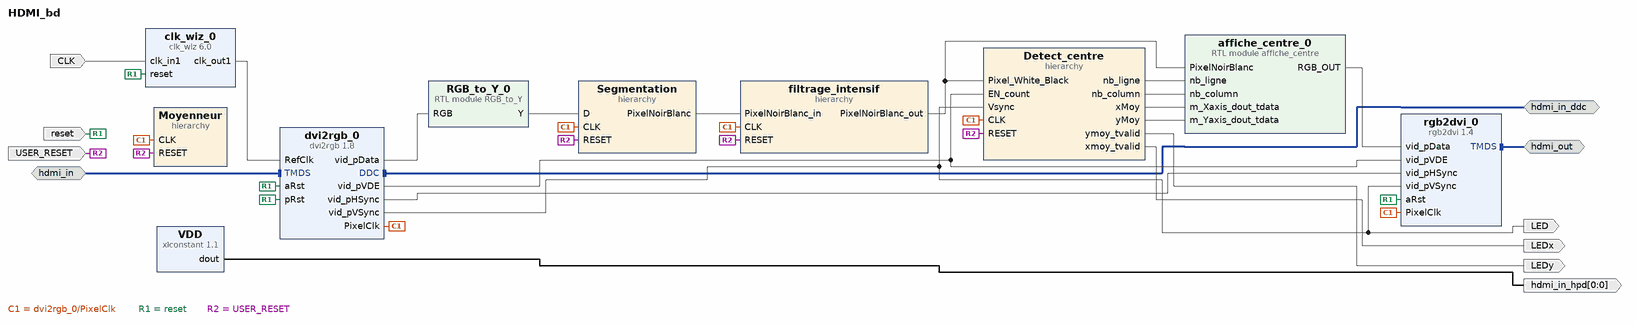
[diagram p0: block diagram of the top level]
# Vivado block design HDMI_bd, xc7z020clg400-1, Vivado 2018.2.1
create_bd_design HDMI_bd

create_bd_intf_port -mode Master -vlnv xilinx.com:interface:iic_rtl:1.0 hdmi_in_ddc
create_bd_intf_port -mode Slave -vlnv digilentinc.com:interface:tmds_rtl:1.0 hdmi_in
create_bd_intf_port -mode Master -vlnv digilentinc.com:interface:tmds_rtl:1.0 hdmi_out
create_bd_port -dir I -type clk CLK
set_property -dict {CONFIG.FREQ_HZ 125000000} [get_bd_ports CLK]
create_bd_port -dir O -from 0 -to 0 hdmi_in_hpd
create_bd_port -dir I -type rst reset
set_property -dict {CONFIG.POLARITY ACTIVE_HIGH} [get_bd_ports reset]
create_bd_port -dir I USER_RESET
create_bd_port -dir O LED
create_bd_port -dir O LEDx
create_bd_port -dir O LEDy

create_bd_cell -type ip -vlnv xilinx.com:ip:clk_wiz:6.0 clk_wiz_0
set_property -dict [list \
  CONFIG.PRIMITIVE PLL \
  CONFIG.CLKOUT1_REQUESTED_OUT_FREQ 200.000 \
  CONFIG.CLKOUT1_DRIVES BUFG \
  CONFIG.CLKOUT2_DRIVES BUFG \
  CONFIG.CLKOUT3_DRIVES BUFG \
  CONFIG.CLKOUT4_DRIVES BUFG \
  CONFIG.CLKOUT5_DRIVES BUFG \
  CONFIG.CLKOUT6_DRIVES BUFG \
  CONFIG.CLKOUT7_DRIVES BUFG \
  CONFIG.MMCM_DIVCLK_DIVIDE 1 \
  CONFIG.MMCM_CLKFBOUT_MULT_F 8 \
  CONFIG.MMCM_COMPENSATION ZHOLD \
  CONFIG.MMCM_CLKOUT0_DIVIDE_F 5 \
  CONFIG.CLKOUT1_JITTER 109.241 \
  CONFIG.CLKOUT1_PHASE_ERROR 96.948 \
] [get_bd_cells clk_wiz_0]
create_bd_cell -type ip -vlnv xilinx.com:ip:xlconstant:1.1 VDD
create_bd_cell -type ip -vlnv digilentinc.com:ip:dvi2rgb:1.8 dvi2rgb_0
set_property -dict [list \
  CONFIG.kEmulateDDC true \
  CONFIG.kEnableSerialClkOutput false \
  CONFIG.kClkRange 3 \
  CONFIG.kEdidFileName dgl_720p_cea.data \
] [get_bd_cells dvi2rgb_0]
create_bd_cell -type ip -vlnv digilentinc.com:ip:rgb2dvi:1.4 rgb2dvi_0
set_property -dict {CONFIG.kClkPrimitive MMCM CONFIG.kGenerateSerialClk true CONFIG.kClkRange 3} [get_bd_cells rgb2dvi_0]
create_bd_cell -type module -reference RGB_to_Y RGB_to_Y_0
create_bd_cell -type hier Segmentation
create_bd_cell -type hier Moyenneur
create_bd_cell -type hier Detect_centre
create_bd_cell -type hier filtrage_intensif
create_bd_cell -type module -reference affiche_centre affiche_centre_0

# ---- hierarchy /Segmentation ----
current_bd_instance /Segmentation
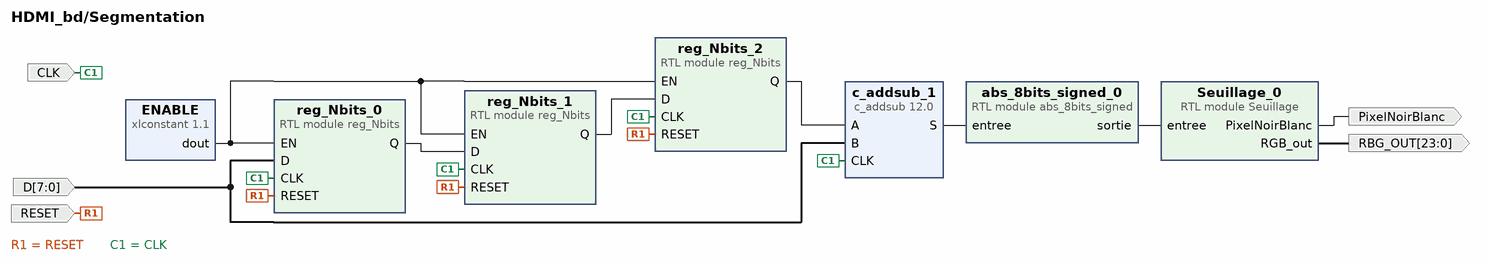
[diagram p1: block diagram inside /Segmentation]
create_bd_pin -dir I -from 7 -to 0 D
create_bd_pin -dir I -type clk CLK
create_bd_pin -dir O -from 23 -to 0 RBG_OUT
create_bd_pin -dir O PixelNoirBlanc
create_bd_pin -dir I RESET

create_bd_cell -type ip -vlnv xilinx.com:ip:xlconstant:1.1 ENABLE
create_bd_cell -type module -reference abs_8bits_signed abs_8bits_signed_0
create_bd_cell -type module -reference reg_Nbits reg_Nbits_0
set_property -dict {CONFIG.N 8} [get_bd_cells reg_Nbits_0]
create_bd_cell -type module -reference reg_Nbits reg_Nbits_1
set_property -dict {CONFIG.N 8} [get_bd_cells reg_Nbits_1]
create_bd_cell -type module -reference Seuillage Seuillage_0
create_bd_cell -type module -reference reg_Nbits reg_Nbits_2
set_property -dict {CONFIG.N 8} [get_bd_cells reg_Nbits_2]
create_bd_cell -type ip -vlnv xilinx.com:ip:c_addsub:12.0 c_addsub_1
set_property -dict [list \
  CONFIG.A_Type Unsigned \
  CONFIG.B_Type Unsigned \
  CONFIG.A_Width 8 \
  CONFIG.B_Width 8 \
  CONFIG.Add_Mode Subtract \
  CONFIG.Out_Width 9 \
  CONFIG.Latency 1 \
  CONFIG.B_Value 00000000 \
  CONFIG.CE false \
] [get_bd_cells c_addsub_1]

# ---- hierarchy /Moyenneur ----
current_bd_instance /Moyenneur
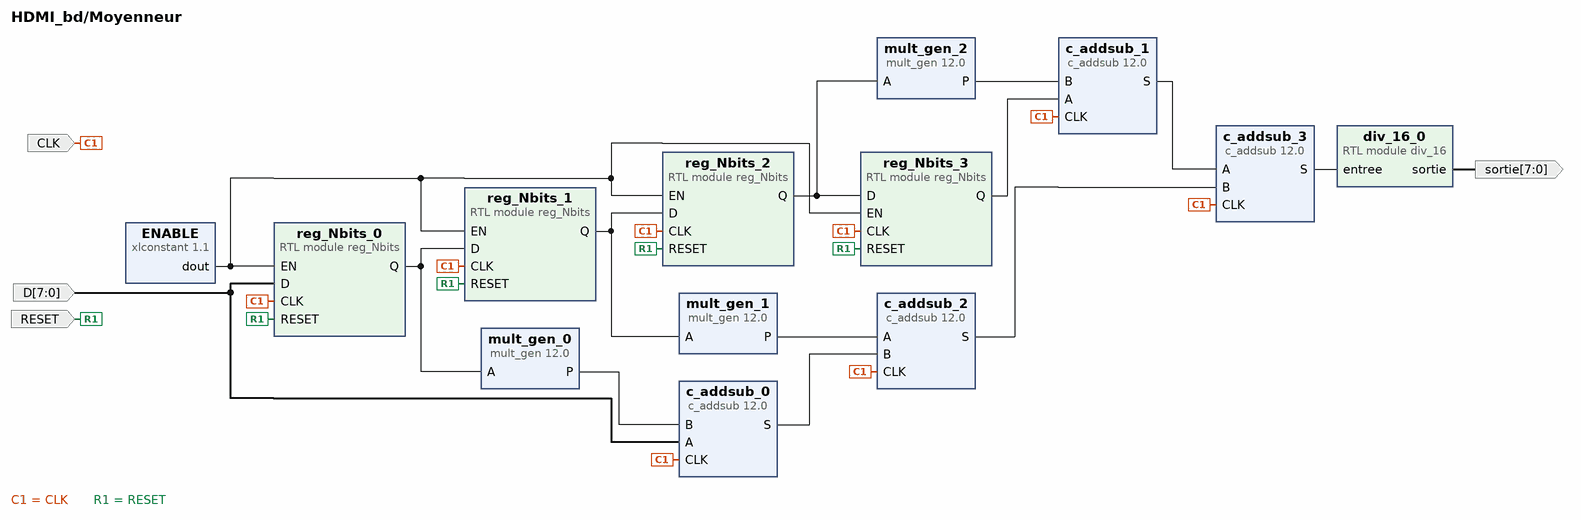
[diagram p2: block diagram inside /Moyenneur]
create_bd_pin -dir I -from 7 -to 0 D
create_bd_pin -dir O -from 7 -to 0 sortie
create_bd_pin -dir I -type clk CLK
create_bd_pin -dir I RESET

create_bd_cell -type ip -vlnv xilinx.com:ip:mult_gen:12.0 mult_gen_0
set_property -dict [list \
  CONFIG.MultType Constant_Coefficient_Multiplier \
  CONFIG.PortAType Unsigned \
  CONFIG.PortAWidth 8 \
  CONFIG.ConstValue 4 \
  CONFIG.Use_Custom_Output_Width false \
] [get_bd_cells mult_gen_0]
create_bd_cell -type ip -vlnv xilinx.com:ip:mult_gen:12.0 mult_gen_1
set_property -dict [list \
  CONFIG.MultType Constant_Coefficient_Multiplier \
  CONFIG.PortAType Unsigned \
  CONFIG.PortAWidth 8 \
  CONFIG.ConstValue 6 \
  CONFIG.Use_Custom_Output_Width false \
  CONFIG.PipeStages 0 \
] [get_bd_cells mult_gen_1]
create_bd_cell -type ip -vlnv xilinx.com:ip:mult_gen:12.0 mult_gen_2
set_property -dict [list \
  CONFIG.MultType Constant_Coefficient_Multiplier \
  CONFIG.PortAType Unsigned \
  CONFIG.PortAWidth 8 \
  CONFIG.ConstValue 4 \
  CONFIG.Use_Custom_Output_Width false \
] [get_bd_cells mult_gen_2]
create_bd_cell -type ip -vlnv xilinx.com:ip:c_addsub:12.0 c_addsub_0
set_property -dict [list \
  CONFIG.A_Width 8 \
  CONFIG.B_Width 11 \
  CONFIG.Out_Width 12 \
  CONFIG.Latency 1 \
  CONFIG.B_Value 00000000000 \
  CONFIG.CE false \
] [get_bd_cells c_addsub_0]
create_bd_cell -type ip -vlnv xilinx.com:ip:c_addsub:12.0 c_addsub_1
set_property -dict [list \
  CONFIG.A_Width 8 \
  CONFIG.B_Width 11 \
  CONFIG.Out_Width 12 \
  CONFIG.Latency 1 \
  CONFIG.B_Value 00000000000 \
  CONFIG.CE false \
] [get_bd_cells c_addsub_1]
create_bd_cell -type ip -vlnv xilinx.com:ip:c_addsub:12.0 c_addsub_2
set_property -dict [list \
  CONFIG.A_Width 11 \
  CONFIG.B_Width 12 \
  CONFIG.Out_Width 13 \
  CONFIG.Latency 1 \
  CONFIG.B_Value 000000000000 \
  CONFIG.CE false \
] [get_bd_cells c_addsub_2]
create_bd_cell -type ip -vlnv xilinx.com:ip:c_addsub:12.0 c_addsub_3
set_property -dict [list \
  CONFIG.A_Width 12 \
  CONFIG.B_Width 13 \
  CONFIG.Out_Width 14 \
  CONFIG.Latency 1 \
  CONFIG.B_Value 0000000000000 \
  CONFIG.CE false \
] [get_bd_cells c_addsub_3]
create_bd_cell -type ip -vlnv xilinx.com:ip:xlconstant:1.1 ENABLE
set_property -dict {CONFIG.CONST_VAL 1} [get_bd_cells ENABLE]
create_bd_cell -type module -reference div_16 div_16_0
create_bd_cell -type module -reference reg_Nbits reg_Nbits_0
set_property -dict {CONFIG.N 8} [get_bd_cells reg_Nbits_0]
create_bd_cell -type module -reference reg_Nbits reg_Nbits_1
set_property -dict {CONFIG.N 8} [get_bd_cells reg_Nbits_1]
create_bd_cell -type module -reference reg_Nbits reg_Nbits_2
set_property -dict {CONFIG.N 8} [get_bd_cells reg_Nbits_2]
create_bd_cell -type module -reference reg_Nbits reg_Nbits_3
set_property -dict {CONFIG.N 8} [get_bd_cells reg_Nbits_3]

# ---- hierarchy /Detect_centre ----
current_bd_instance /Detect_centre
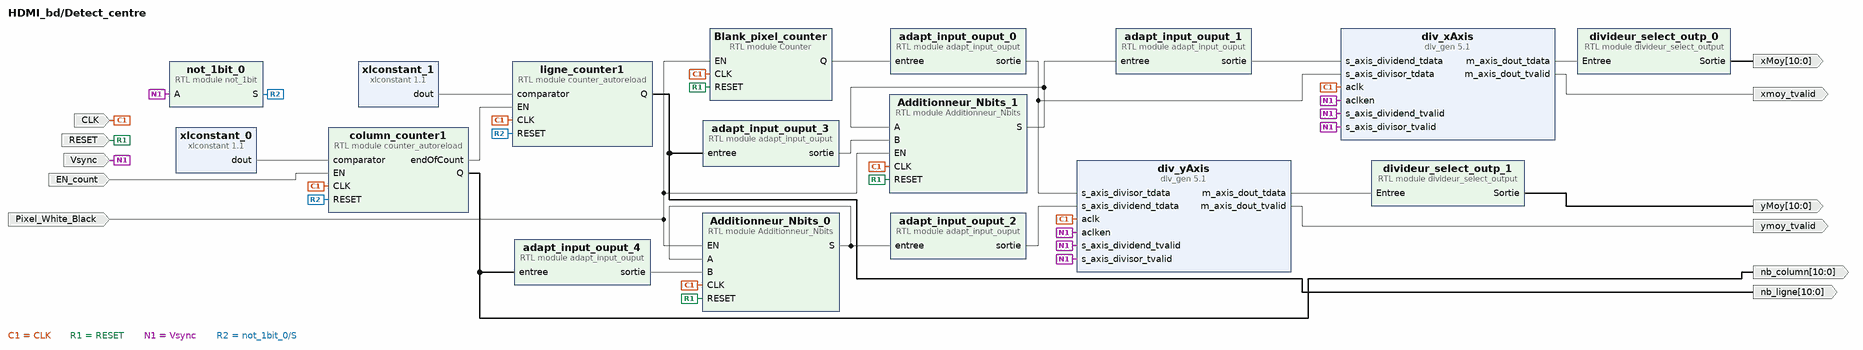
[diagram p3: block diagram inside /Detect_centre]
create_bd_pin -dir I -type clk CLK
create_bd_pin -dir I Pixel_White_Black
create_bd_pin -dir O ymoy_tvalid
create_bd_pin -dir O xmoy_tvalid
create_bd_pin -dir I EN_count
create_bd_pin -dir I RESET
create_bd_pin -dir O -from 10 -to 0 nb_ligne
create_bd_pin -dir O -from 10 -to 0 nb_column
create_bd_pin -dir I Vsync
create_bd_pin -dir O -from 10 -to 0 xMoy
create_bd_pin -dir O -from 10 -to 0 yMoy

create_bd_cell -type module -reference Counter Blank_pixel_counter
set_property -dict {CONFIG.N 11} [get_bd_cells Blank_pixel_counter]
create_bd_cell -type module -reference adapt_input_ouput adapt_input_ouput_0
set_property -dict {CONFIG.N 11 CONFIG.M 16} [get_bd_cells adapt_input_ouput_0]
create_bd_cell -type module -reference adapt_input_ouput adapt_input_ouput_1
set_property -dict {CONFIG.N 18 CONFIG.M 24} [get_bd_cells adapt_input_ouput_1]
create_bd_cell -type module -reference adapt_input_ouput adapt_input_ouput_2
set_property -dict {CONFIG.N 18 CONFIG.M 24} [get_bd_cells adapt_input_ouput_2]
create_bd_cell -type module -reference adapt_input_ouput adapt_input_ouput_3
set_property -dict {CONFIG.N 11 CONFIG.M 18} [get_bd_cells adapt_input_ouput_3]
create_bd_cell -type module -reference adapt_input_ouput adapt_input_ouput_4
set_property -dict {CONFIG.N 11 CONFIG.M 18} [get_bd_cells adapt_input_ouput_4]
create_bd_cell -type ip -vlnv xilinx.com:ip:div_gen:5.1 div_xAxis
set_property -dict [list \
  CONFIG.algorithm_type High_Radix \
  CONFIG.dividend_and_quotient_width 18 \
  CONFIG.dividend_has_tuser false \
  CONFIG.dividend_has_tlast false \
  CONFIG.divisor_width 11 \
  CONFIG.remainder_type Fractional \
  CONFIG.fractional_width 0 \
  CONFIG.operand_sign Signed \
  CONFIG.clocks_per_division 1 \
  CONFIG.divide_by_zero_detect false \
  CONFIG.OutTLASTBehv Null \
  CONFIG.latency 21 \
  CONFIG.ACLKEN true \
] [get_bd_cells div_xAxis]
create_bd_cell -type ip -vlnv xilinx.com:ip:div_gen:5.1 div_yAxis
set_property -dict [list \
  CONFIG.algorithm_type High_Radix \
  CONFIG.dividend_and_quotient_width 18 \
  CONFIG.dividend_has_tuser false \
  CONFIG.dividend_has_tlast false \
  CONFIG.divisor_width 11 \
  CONFIG.remainder_type Fractional \
  CONFIG.fractional_width 0 \
  CONFIG.operand_sign Signed \
  CONFIG.clocks_per_division 1 \
  CONFIG.divide_by_zero_detect false \
  CONFIG.OutTLASTBehv Null \
  CONFIG.latency 21 \
  CONFIG.ACLKEN true \
] [get_bd_cells div_yAxis]
create_bd_cell -type module -reference Additionneur_Nbits Additionneur_Nbits_0
set_property -dict {CONFIG.N 18} [get_bd_cells Additionneur_Nbits_0]
create_bd_cell -type module -reference Additionneur_Nbits Additionneur_Nbits_1
set_property -dict {CONFIG.N 18} [get_bd_cells Additionneur_Nbits_1]
create_bd_cell -type ip -vlnv xilinx.com:ip:xlconstant:1.1 xlconstant_0
set_property -dict {CONFIG.CONST_WIDTH 11 CONFIG.CONST_VAL 1599} [get_bd_cells xlconstant_0]
create_bd_cell -type ip -vlnv xilinx.com:ip:xlconstant:1.1 xlconstant_1
set_property -dict {CONFIG.CONST_WIDTH 11 CONFIG.CONST_VAL 899} [get_bd_cells xlconstant_1]
create_bd_cell -type module -reference counter_autoreload column_counter1
set_property -dict {CONFIG.N 11} [get_bd_cells column_counter1]
create_bd_cell -type module -reference counter_autoreload ligne_counter1
set_property -dict {CONFIG.N 11} [get_bd_cells ligne_counter1]
create_bd_cell -type module -reference not_1bit not_1bit_0
create_bd_cell -type module -reference divideur_select_output divideur_select_outp_0
create_bd_cell -type module -reference divideur_select_output divideur_select_outp_1

# ---- hierarchy /filtrage_intensif ----
current_bd_instance /filtrage_intensif
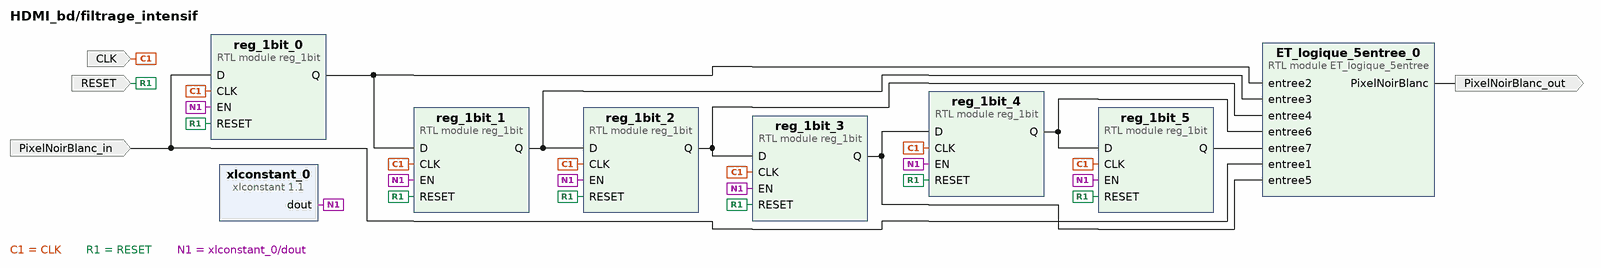
[diagram p4: block diagram inside /filtrage_intensif]
create_bd_pin -dir I PixelNoirBlanc_in
create_bd_pin -dir O PixelNoirBlanc_out
create_bd_pin -dir I CLK
create_bd_pin -dir I RESET

create_bd_cell -type module -reference reg_1bit reg_1bit_0
create_bd_cell -type module -reference reg_1bit reg_1bit_1
create_bd_cell -type module -reference reg_1bit reg_1bit_2
create_bd_cell -type module -reference reg_1bit reg_1bit_3
create_bd_cell -type ip -vlnv xilinx.com:ip:xlconstant:1.1 xlconstant_0
create_bd_cell -type module -reference reg_1bit reg_1bit_4
create_bd_cell -type module -reference reg_1bit reg_1bit_5
create_bd_cell -type module -reference ET_logique_5entree ET_logique_5entree_0

# ---- connections ----

current_bd_instance /Segmentation
connect_bd_net [get_bd_pins RESET] [get_bd_pins reg_Nbits_0/RESET] [get_bd_pins reg_Nbits_1/RESET] [get_bd_pins reg_Nbits_2/RESET]
connect_bd_net [get_bd_pins ENABLE/dout] [get_bd_pins reg_Nbits_0/EN] [get_bd_pins reg_Nbits_1/EN] [get_bd_pins reg_Nbits_2/EN]
connect_bd_net [get_bd_pins CLK] \
  [get_bd_pins reg_Nbits_0/CLK] [get_bd_pins reg_Nbits_1/CLK] [get_bd_pins reg_Nbits_2/CLK] [get_bd_pins c_addsub_1/CLK]
connect_bd_net [get_bd_pins Seuillage_0/PixelNoirBlanc] [get_bd_pins PixelNoirBlanc]
connect_bd_net [get_bd_pins Seuillage_0/RGB_out] [get_bd_pins RBG_OUT]
connect_bd_net [get_bd_pins reg_Nbits_0/Q] [get_bd_pins reg_Nbits_1/D]
connect_bd_net [get_bd_pins abs_8bits_signed_0/sortie] [get_bd_pins Seuillage_0/entree]
connect_bd_net [get_bd_pins reg_Nbits_1/Q] [get_bd_pins reg_Nbits_2/D]
connect_bd_net [get_bd_pins reg_Nbits_2/Q] [get_bd_pins c_addsub_1/A]
connect_bd_net [get_bd_pins D] [get_bd_pins reg_Nbits_0/D] [get_bd_pins c_addsub_1/B]
connect_bd_net [get_bd_pins c_addsub_1/S] [get_bd_pins abs_8bits_signed_0/entree]

current_bd_instance /Moyenneur
connect_bd_net [get_bd_pins reg_Nbits_0/Q] [get_bd_pins mult_gen_0/A] [get_bd_pins reg_Nbits_1/D]
connect_bd_net [get_bd_pins mult_gen_0/P] [get_bd_pins c_addsub_0/B]
connect_bd_net [get_bd_pins reg_Nbits_1/Q] [get_bd_pins mult_gen_1/A] [get_bd_pins reg_Nbits_2/D]
connect_bd_net [get_bd_pins mult_gen_1/P] [get_bd_pins c_addsub_2/A]
connect_bd_net [get_bd_pins reg_Nbits_2/Q] [get_bd_pins mult_gen_2/A] [get_bd_pins reg_Nbits_3/D]
connect_bd_net [get_bd_pins mult_gen_2/P] [get_bd_pins c_addsub_1/B]
connect_bd_net [get_bd_pins c_addsub_0/S] [get_bd_pins c_addsub_2/B]
connect_bd_net [get_bd_pins reg_Nbits_3/Q] [get_bd_pins c_addsub_1/A]
connect_bd_net [get_bd_pins c_addsub_1/S] [get_bd_pins c_addsub_3/A]
connect_bd_net [get_bd_pins c_addsub_2/S] [get_bd_pins c_addsub_3/B]
connect_bd_net [get_bd_pins c_addsub_3/S] [get_bd_pins div_16_0/entree]
connect_bd_net [get_bd_pins ENABLE/dout] \
  [get_bd_pins reg_Nbits_0/EN] [get_bd_pins reg_Nbits_1/EN] [get_bd_pins reg_Nbits_2/EN] [get_bd_pins reg_Nbits_3/EN]
connect_bd_net [get_bd_pins CLK] \
  [get_bd_pins c_addsub_3/CLK] [get_bd_pins c_addsub_1/CLK] [get_bd_pins c_addsub_2/CLK] [get_bd_pins c_addsub_0/CLK] \
  [get_bd_pins reg_Nbits_0/CLK] [get_bd_pins reg_Nbits_1/CLK] [get_bd_pins reg_Nbits_2/CLK] [get_bd_pins reg_Nbits_3/CLK]
connect_bd_net [get_bd_pins D] [get_bd_pins c_addsub_0/A] [get_bd_pins reg_Nbits_0/D]
connect_bd_net -net div_16_0_OUTPUT [get_bd_pins div_16_0/sortie] [get_bd_pins sortie]
connect_bd_net -net xlconstant_0_dout [get_bd_pins RESET] \
  [get_bd_pins reg_Nbits_0/RESET] [get_bd_pins reg_Nbits_1/RESET] [get_bd_pins reg_Nbits_2/RESET] \
  [get_bd_pins reg_Nbits_3/RESET]

current_bd_instance /Detect_centre
connect_bd_net [get_bd_pins Additionneur_Nbits_0/S] [get_bd_pins adapt_input_ouput_2/entree] [get_bd_pins Additionneur_Nbits_0/A]
connect_bd_net [get_bd_pins Additionneur_Nbits_1/S] [get_bd_pins adapt_input_ouput_1/entree] [get_bd_pins Additionneur_Nbits_1/A]
connect_bd_net [get_bd_pins CLK] \
  [get_bd_pins div_xAxis/aclk] [get_bd_pins div_yAxis/aclk] [get_bd_pins Blank_pixel_counter/CLK] \
  [get_bd_pins Additionneur_Nbits_0/CLK] [get_bd_pins Additionneur_Nbits_1/CLK] [get_bd_pins column_counter1/CLK] \
  [get_bd_pins ligne_counter1/CLK]
connect_bd_net [get_bd_pins Pixel_White_Black] \
  [get_bd_pins Blank_pixel_counter/EN] [get_bd_pins Additionneur_Nbits_0/EN] [get_bd_pins Additionneur_Nbits_1/EN]
connect_bd_net [get_bd_pins adapt_input_ouput_0/sortie] [get_bd_pins div_xAxis/s_axis_divisor_tdata] [get_bd_pins div_yAxis/s_axis_divisor_tdata]
connect_bd_net [get_bd_pins adapt_input_ouput_1/sortie] [get_bd_pins div_xAxis/s_axis_dividend_tdata]
connect_bd_net [get_bd_pins adapt_input_ouput_2/sortie] [get_bd_pins div_yAxis/s_axis_dividend_tdata]
connect_bd_net [get_bd_pins adapt_input_ouput_3/sortie] [get_bd_pins Additionneur_Nbits_1/B]
connect_bd_net [get_bd_pins adapt_input_ouput_4/sortie] [get_bd_pins Additionneur_Nbits_0/B]
connect_bd_net -net column_counter_Q [get_bd_pins column_counter1/Q] [get_bd_pins nb_column] [get_bd_pins adapt_input_ouput_4/entree]
connect_bd_net [get_bd_pins div_xAxis/m_axis_dout_tdata] [get_bd_pins divideur_select_outp_0/Entree]
connect_bd_net [get_bd_pins div_yAxis/m_axis_dout_tdata] [get_bd_pins divideur_select_outp_1/Entree]
connect_bd_net -net ligne_counter2_Q [get_bd_pins Blank_pixel_counter/Q] [get_bd_pins adapt_input_ouput_0/entree]
connect_bd_net -net ligne_counter_Q [get_bd_pins ligne_counter1/Q] [get_bd_pins nb_ligne] [get_bd_pins adapt_input_ouput_3/entree]
connect_bd_net [get_bd_pins div_yAxis/m_axis_dout_tvalid] [get_bd_pins ymoy_tvalid]
connect_bd_net [get_bd_pins div_xAxis/m_axis_dout_tvalid] [get_bd_pins xmoy_tvalid]
connect_bd_net [get_bd_pins xlconstant_0/dout] [get_bd_pins column_counter1/comparator]
connect_bd_net [get_bd_pins xlconstant_1/dout] [get_bd_pins ligne_counter1/comparator]
connect_bd_net [get_bd_pins EN_count] [get_bd_pins column_counter1/EN]
connect_bd_net [get_bd_pins RESET] \
  [get_bd_pins Additionneur_Nbits_0/RESET] [get_bd_pins Blank_pixel_counter/RESET] [get_bd_pins Additionneur_Nbits_1/RESET]
connect_bd_net [get_bd_pins column_counter1/endOfCount] [get_bd_pins ligne_counter1/EN]
connect_bd_net [get_bd_pins Vsync] \
  [get_bd_pins not_1bit_0/A] [get_bd_pins div_xAxis/s_axis_divisor_tvalid] [get_bd_pins div_xAxis/s_axis_dividend_tvalid] \
  [get_bd_pins div_yAxis/s_axis_divisor_tvalid] [get_bd_pins div_yAxis/s_axis_dividend_tvalid] [get_bd_pins div_xAxis/aclken] \
  [get_bd_pins div_yAxis/aclken]
connect_bd_net [get_bd_pins not_1bit_0/S] [get_bd_pins column_counter1/RESET] [get_bd_pins ligne_counter1/RESET]
connect_bd_net [get_bd_pins divideur_select_outp_0/Sortie] [get_bd_pins xMoy]
connect_bd_net [get_bd_pins divideur_select_outp_1/Sortie] [get_bd_pins yMoy]

current_bd_instance /filtrage_intensif
connect_bd_net [get_bd_pins reg_1bit_0/Q] [get_bd_pins reg_1bit_1/D] [get_bd_pins ET_logique_5entree_0/entree2]
connect_bd_net [get_bd_pins reg_1bit_1/Q] [get_bd_pins reg_1bit_2/D] [get_bd_pins ET_logique_5entree_0/entree3]
connect_bd_net [get_bd_pins reg_1bit_2/Q] [get_bd_pins reg_1bit_3/D] [get_bd_pins ET_logique_5entree_0/entree4]
connect_bd_net [get_bd_pins CLK] \
  [get_bd_pins reg_1bit_3/CLK] [get_bd_pins reg_1bit_2/CLK] [get_bd_pins reg_1bit_1/CLK] [get_bd_pins reg_1bit_0/CLK] \
  [get_bd_pins reg_1bit_4/CLK] [get_bd_pins reg_1bit_5/CLK]
connect_bd_net [get_bd_pins RESET] \
  [get_bd_pins reg_1bit_0/RESET] [get_bd_pins reg_1bit_1/RESET] [get_bd_pins reg_1bit_2/RESET] [get_bd_pins reg_1bit_3/RESET] \
  [get_bd_pins reg_1bit_4/RESET] [get_bd_pins reg_1bit_5/RESET]
connect_bd_net [get_bd_pins xlconstant_0/dout] \
  [get_bd_pins reg_1bit_3/EN] [get_bd_pins reg_1bit_2/EN] [get_bd_pins reg_1bit_1/EN] [get_bd_pins reg_1bit_0/EN] \
  [get_bd_pins reg_1bit_4/EN] [get_bd_pins reg_1bit_5/EN]
connect_bd_net -net PixelNoirBlanc_1 [get_bd_pins PixelNoirBlanc_in] [get_bd_pins reg_1bit_0/D] [get_bd_pins ET_logique_5entree_0/entree1]
connect_bd_net [get_bd_pins ET_logique_5entree_0/PixelNoirBlanc] [get_bd_pins PixelNoirBlanc_out]
connect_bd_net [get_bd_pins reg_1bit_3/Q] [get_bd_pins reg_1bit_4/D] [get_bd_pins ET_logique_5entree_0/entree5]
connect_bd_net [get_bd_pins reg_1bit_4/Q] [get_bd_pins reg_1bit_5/D] [get_bd_pins ET_logique_5entree_0/entree6]
connect_bd_net [get_bd_pins reg_1bit_5/Q] [get_bd_pins ET_logique_5entree_0/entree7]

current_bd_instance /
connect_bd_intf_net [get_bd_intf_ports hdmi_in_ddc] [get_bd_intf_pins dvi2rgb_0/DDC]
connect_bd_intf_net [get_bd_intf_ports hdmi_in] [get_bd_intf_pins dvi2rgb_0/TMDS]
connect_bd_intf_net [get_bd_intf_ports hdmi_out] [get_bd_intf_pins rgb2dvi_0/TMDS]
connect_bd_net [get_bd_ports CLK] [get_bd_pins clk_wiz_0/clk_in1]
connect_bd_net [get_bd_pins VDD/dout] [get_bd_ports hdmi_in_hpd]
connect_bd_net [get_bd_pins clk_wiz_0/clk_out1] [get_bd_pins dvi2rgb_0/RefClk]
connect_bd_net [get_bd_pins dvi2rgb_0/vid_pVDE] [get_bd_pins rgb2dvi_0/vid_pVDE] [get_bd_pins Detect_centre/EN_count]
connect_bd_net [get_bd_pins dvi2rgb_0/vid_pData] [get_bd_pins RGB_to_Y_0/RGB]
connect_bd_net [get_bd_pins dvi2rgb_0/vid_pHSync] [get_bd_pins rgb2dvi_0/vid_pHSync]
connect_bd_net -net CLK_2 [get_bd_pins dvi2rgb_0/PixelClk] \
  [get_bd_pins rgb2dvi_0/PixelClk] [get_bd_pins Segmentation/CLK] [get_bd_pins Moyenneur/CLK] \
  [get_bd_pins filtrage_intensif/CLK] [get_bd_pins Detect_centre/CLK]
connect_bd_net [get_bd_pins affiche_centre_0/RGB_OUT] [get_bd_pins rgb2dvi_0/vid_pData]
connect_bd_net -net PixelNoirBlanc_in_1 [get_bd_pins Segmentation/PixelNoirBlanc] [get_bd_pins filtrage_intensif/PixelNoirBlanc_in]
connect_bd_net [get_bd_pins filtrage_intensif/PixelNoirBlanc_out] \
  [get_bd_pins affiche_centre_0/PixelNoirBlanc] [get_bd_pins Detect_centre/Pixel_White_Black]
connect_bd_net -net D_1 [get_bd_pins RGB_to_Y_0/Y] [get_bd_pins Segmentation/D]
connect_bd_net [get_bd_ports reset] \
  [get_bd_pins clk_wiz_0/reset] [get_bd_pins dvi2rgb_0/aRst] [get_bd_pins dvi2rgb_0/pRst] [get_bd_pins rgb2dvi_0/aRst]
connect_bd_net -net reg_1bit_0_Q [get_bd_ports USER_RESET] \
  [get_bd_pins Moyenneur/RESET] [get_bd_pins Segmentation/RESET] [get_bd_pins filtrage_intensif/RESET] \
  [get_bd_pins Detect_centre/RESET]
connect_bd_net [get_bd_pins dvi2rgb_0/vid_pVSync] [get_bd_ports LED] [get_bd_pins rgb2dvi_0/vid_pVSync] [get_bd_pins Detect_centre/Vsync]
connect_bd_net [get_bd_pins Detect_centre/nb_ligne] [get_bd_pins affiche_centre_0/nb_ligne]
connect_bd_net [get_bd_pins Detect_centre/nb_column] [get_bd_pins affiche_centre_0/nb_column]
connect_bd_net [get_bd_pins Detect_centre/xMoy] [get_bd_pins affiche_centre_0/m_Xaxis_dout_tdata]
connect_bd_net [get_bd_pins Detect_centre/yMoy] [get_bd_pins affiche_centre_0/m_Yaxis_dout_tdata]
connect_bd_net [get_bd_pins Detect_centre/ymoy_tvalid] [get_bd_ports LEDy]
connect_bd_net [get_bd_pins Detect_centre/xmoy_tvalid] [get_bd_ports LEDx]

validate_bd_design
save_bd_design
